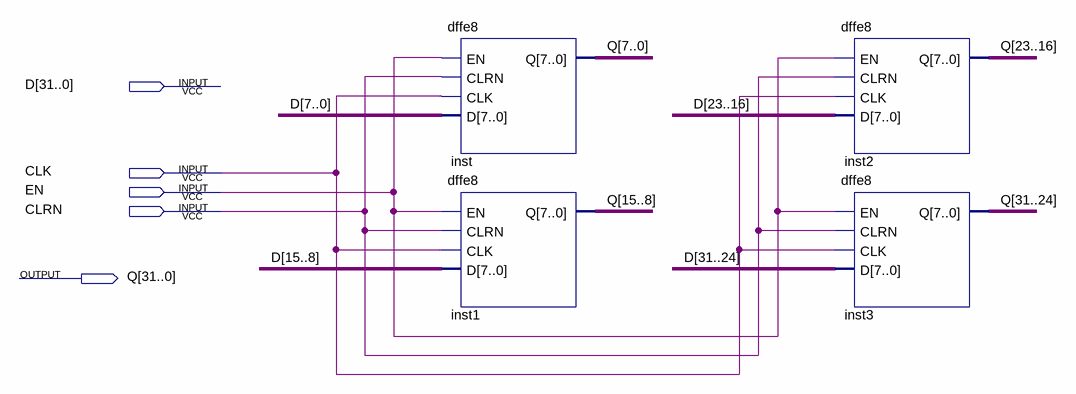
[diagram p0: schematic sheet]
// Quartus schematic dffe32.bdf as structural Verilog: 4 symbols, 5 pins
module dffe32 (
  input  [31:0] D,
  input  CLK,
  input  EN,
  input  CLRN,
  output [31:0] Q
);

  dffe8 inst (.EN(EN), .CLRN(CLRN), .CLK(CLK), .D(D[7:0]), .Q(Q[7:0]));
  dffe8 inst1 (.EN(EN), .CLRN(CLRN), .CLK(CLK), .D(D[15:8]), .Q(Q[15:8]));
  dffe8 inst2 (.EN(EN), .CLRN(CLRN), .CLK(CLK), .D(D[23:16]), .Q(Q[23:16]));
  dffe8 inst3 (.EN(EN), .CLRN(CLRN), .CLK(CLK), .D(D[31:24]), .Q(Q[31:24]));
endmodule
